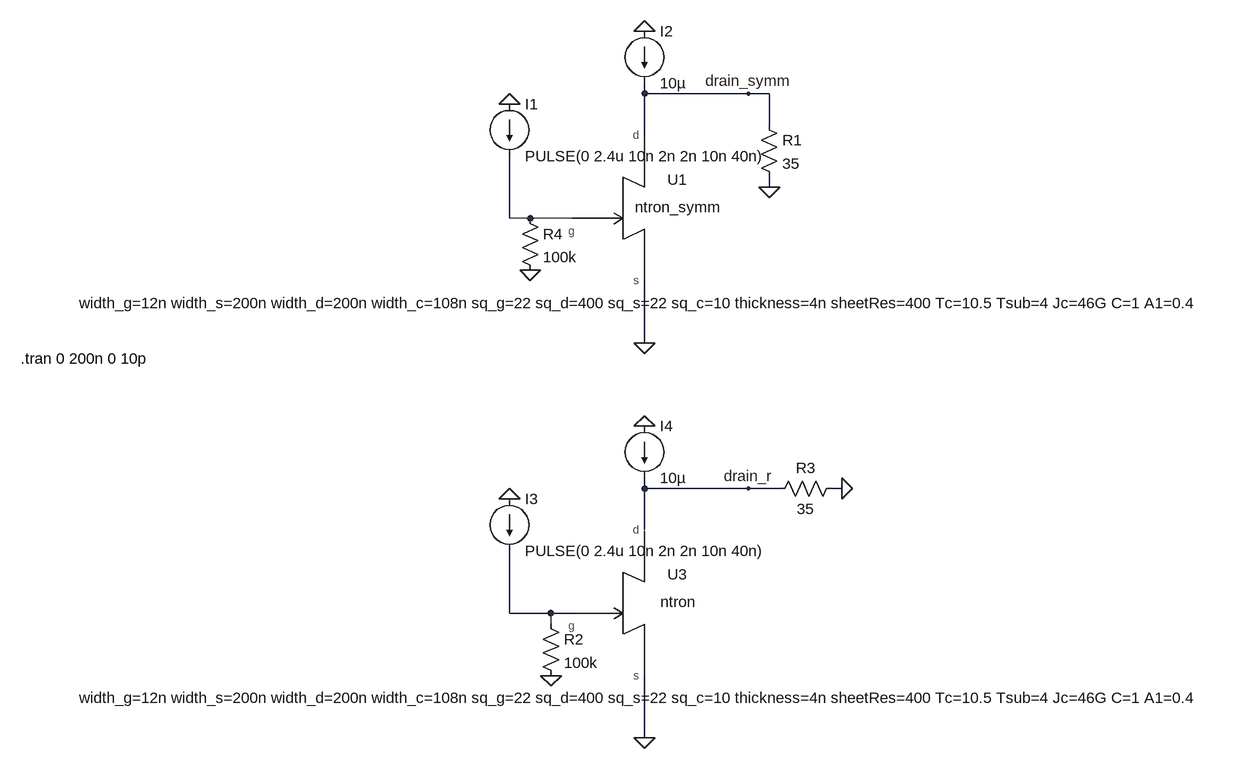
[diagram p0: schematic ntron_symm_test.asc]
ntron_symm_test.asc, the LTspice schematic file:
Version 4
SHEET 1 2536 964
WIRE 256 -48 256 -64
WIRE 416 -48 256 -48
WIRE 448 -48 416 -48
WIRE 448 0 448 -48
WIRE 256 16 256 -48
WIRE 448 96 448 80
WIRE 48 144 48 48
WIRE 80 144 48 144
WIRE 144 144 80 144
WIRE 256 336 256 240
WIRE 256 560 256 544
WIRE 416 560 256 560
WIRE 464 560 416 560
WIRE 560 560 544 560
WIRE 256 624 256 560
WIRE 48 752 48 656
WIRE 112 752 48 752
WIRE 144 752 112 752
WIRE 112 768 112 752
WIRE 256 944 256 848
FLAG 256 336 0
FLAG 448 96 0
FLAG 256 -144 0
FLAG 48 -32 0
FLAG 256 944 0
FLAG 560 560 0
FLAG 256 464 0
FLAG 48 576 0
FLAG 416 -48 drain_symm
FLAG 416 560 drain_r
FLAG 112 848 0
FLAG 80 224 0
SYMBOL ntron_symm 256 128 R0
SYMATTR InstName U1
SYMATTR SpiceLine width_g=12n width_s=200n width_d=200n width_c=108n sq_g=22 sq_d=400 sq_s=22 sq_c=10 thickness=4n sheetRes=400 Tc=10.5 Tsub=4 Jc=46G C=1 A1=0.4
SYMBOL current 48 -32 R0
WINDOW 123 0 0 Left 0
WINDOW 39 0 0 Left 0
SYMATTR InstName I1
SYMATTR Value PULSE(0 2.4u 10n 2n 2n 10n 40n)
SYMBOL current 256 -144 R0
WINDOW 123 0 0 Left 0
WINDOW 39 0 0 Left 0
SYMATTR InstName I2
SYMATTR Value 10µ
SYMBOL res 432 -16 R0
SYMATTR InstName R1
SYMATTR Value 35
SYMBOL current 48 576 R0
WINDOW 123 0 0 Left 0
WINDOW 39 0 0 Left 0
SYMATTR InstName I3
SYMATTR Value PULSE(0 2.4u 10n 2n 2n 10n 40n)
SYMBOL current 256 464 R0
WINDOW 123 0 0 Left 0
WINDOW 39 0 0 Left 0
SYMATTR InstName I4
SYMATTR Value 10µ
SYMBOL res 448 576 R270
WINDOW 0 32 56 VTop 2
WINDOW 3 0 56 VBottom 2
SYMATTR InstName R3
SYMATTR Value 35
SYMBOL res 96 752 R0
SYMATTR InstName R2
SYMATTR Value 100k
SYMBOL res 64 128 R0
SYMATTR InstName R4
SYMATTR Value 100k
SYMBOL qnn-spice\\ntrons\\ntron 256 736 R0
SYMATTR InstName U3
SYMATTR SpiceLine width_g=12n width_s=200n width_d=200n width_c=108n sq_g=22 sq_d=400 sq_s=22 sq_c=10 thickness=4n sheetRes=400 Tc=10.5 Tsub=4 Jc=46G C=1 A1=0.4
TEXT -704 360 Left 2 !.tran 0 200n 0 10p

The netlist it stands for:
* ntron_symm_test.asc
XU1 N001 drain_symm 0 ntron_symm width_g=12n width_s=200n width_d=200n width_c=108n sq_g=22 sq_d=400 sq_s=22 sq_c=10 thickness=4n sheetRes=400 Tc=10.5 Tsub=4 Jc=46G C=1 A1=0.4  ; pins g d s
I1 0 N001 PULSE(0 2.4u 10n 2n 2n 10n 40n)
I2 0 drain_symm 10µ
R1 drain_symm 0 35
I3 0 N002 PULSE(0 2.4u 10n 2n 2n 10n 40n)
I4 0 drain_r 10µ
R3 drain_r 0 35
R2 N002 0 100k
R4 N001 0 100k
XU3 N002 drain_r 0 ntron width_g=12n width_s=200n width_d=200n width_c=108n sq_g=22 sq_d=400 sq_s=22 sq_c=10 thickness=4n sheetRes=400 Tc=10.5 Tsub=4 Jc=46G C=1 A1=0.4  ; pins g d s
.tran 0 200n 0 10p
.lib ntron_symm.lib
.lib ntron.lib
.backanno
.end